# EAGLE schematic pcb v1 mod (EAGLE 7.4.0)
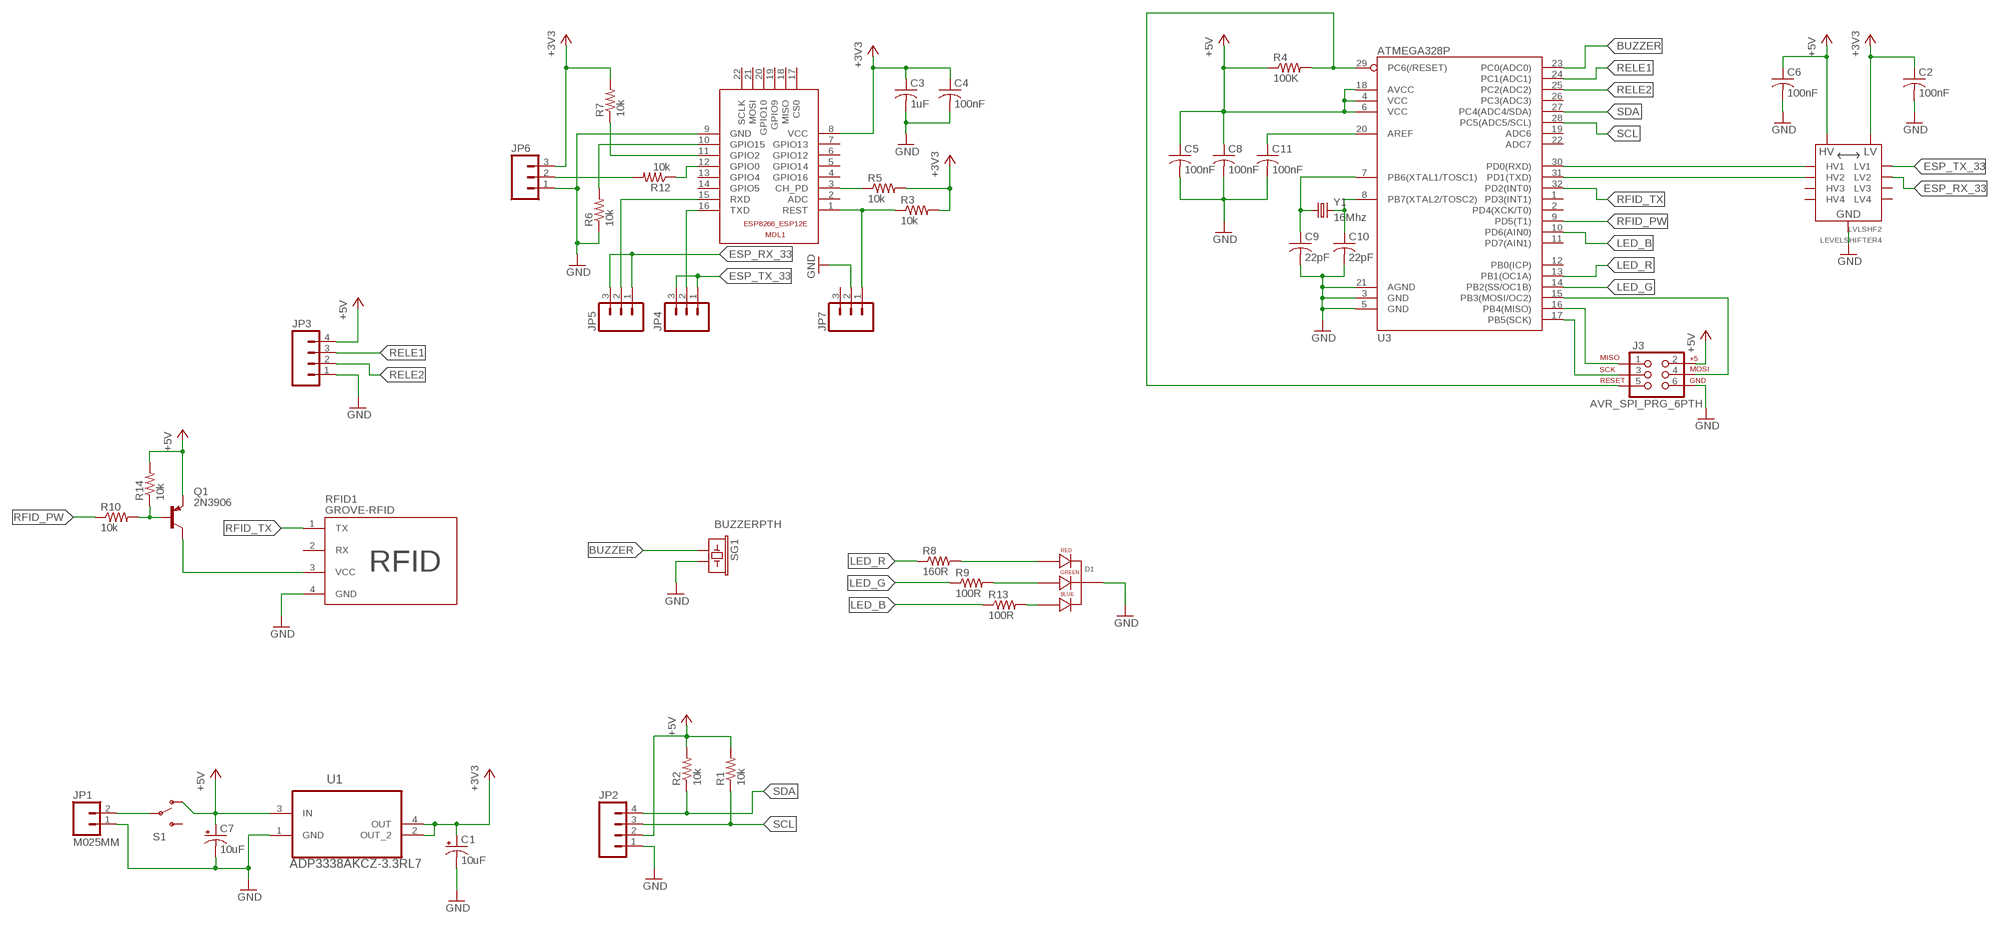
[diagram p0: schematic, sheet 1]

## Parts
C1  10uF  CPOL-USE2.5-6  [E2,5-6]
C2  100nF  C-USC0805  [C0805]
C3  1uF  C-USC1206  [C1206]
C4  100nF  C-USC0805  [C0805]
C5  100nF  C-USC0805  [C0805]
C6  100nF  C-USC0805  [C0805]
C7  10uF  CPOL-USE2.5-6  [E2,5-6]
C8  100nF  C-USC0805  [C0805]
C9  22pF  C-USC1206  [C1206]
C10  22pF  C-USC1206  [C1206]
C11  100nF  C-USC0805  [C0805]
D1  LED-RGB-CC-THRUCLEAR  [LED-RGB-THRU]
J3  AVR_SPI_PRG_6PTH  [2X3]
JP1  M025MM  [SCREWTERMINAL-5MM-2]
JP2  M04PTH  [1X04]
JP3  M04PTH  [1X04]
JP4  M03PTH  [1X03]
JP5  M03PTH  [1X03]
JP6  M03PTH  [1X03]
JP7  M03PTH  [1X03]
LVLSHF2  LEVELSHIFTER4  [LEVELSHIFTER4]
MDL1  ESP8266-12EESP8266-ESP12E  [ESP8266-ESP12E]
Q1  2N3906  [TO92]
R1  10k  R-US_R0805  [R0805]
R2  10k  R-US_R0805  [R0805]
R3  10k  R-US_R0805  [R0805]
R4  100K  R-US_R0805  [R0805]
R5  10k  R-US_R0805  [R0805]
R6  10k  R-US_R0805  [R0805]
R7  10k  R-US_R0805  [R0805]
R8  160R  R-US_R1206  [R1206]
R9  100R  R-US_R0805  [R0805]
R10  10k  R-US_R0805  [R0805]
R12  10k  R-US_R0805  [R0805]
R13  100R  R-US_R0805  [R0805]
R14  10k  R-US_R0805  [R0805]
RFID1  GROVE-RFID  [GROVE-RFID]
S1  SWITCH-SPDTPTH  [SWITCH-SPDT]
SG1  BUZZERPTH  [BUZZER-12MM]
U1  ADP3338AKCZ-3.3RL7  [SOT230P700X180-4N]
U3  ATMEGA328P  ATMEGA328_SMT  [TQFP32-08]
Y1  16Mhz  CRYSTALHC49US  [HC49US]

## Nets
+3V3: C1.+ C2.1 C3.1 C4.1 JP6.3 LVLSHF2.LV MDL1.8(VCC) R3.2 R5.2 R7.2 U1.2(OUT_2) U1.4(OUT)
+5V: C5.1 C6.1 C7.+ C8.1 J3.2 JP2.2 JP3.4 LVLSHF2.HV Q1.3(E) R1.2 R2.2 R4.1 R14.2 S1.1(O) U1.3(IN) U3.4(VCC) U3.6(VCC) U3.18(AVCC)
BUZZER: SG1.+ U3.23(PC0(ADC0))
ESP_RX_33: JP5.1 JP5.3 LVLSHF2.LV2
ESP_TX_33: JP4.1 JP4.3 LVLSHF2.LV1
GND: C1.- C2.2 C3.2 C4.2 C5.2 C6.2 C7.- C8.2 C9.2 C10.2 C11.2 D1.2(CATHODE) J3.6 JP1.1 JP2.1 JP3.1 JP6.1 JP7.2 LVLSHF2.GND LVLSHF2.GND1(GND) MDL1.9(GND) R6.1 RFID1.4(GND) SG1.- U1.1(GND) U3.3(GND) U3.5(GND) U3.21(AGND)
LED_B: R13.1 U3.10(PD6(AIN0))
LED_G: R9.1 U3.14(PB2(SS/OC1B))
LED_R: R8.1 U3.13(PB1(OC1A))
N$1: JP1.2 S1.2(P)
N$2: MDL1.3(CH_PD) R5.1
N$3: MDL1.11(GPIO2) R7.1
N$4: MDL1.12(GPIO0) R12.1
N$5: MDL1.10(GPIO15) R6.2
N$6: JP5.2 MDL1.15(RXD)
N$7: Q1.2(B) R10.2 R14.1
N$8: JP4.2 MDL1.16(TXD)
N$9: JP7.1 MDL1.1(REST) R3.1
N$10: D1.1(RED_CATHODE) R8.2
N$11: C9.1 U3.7(PB6(XTAL1/TOSC1)) Y1.1
N$12: C10.1 U3.8(PB7(XTAL2/TOSC2)) Y1.2
N$14: C11.1 U3.20(AREF)
N$15: D1.3(GREEN_CATHODE) R9.2
N$16: D1.4(BLUE_CATHODE) R13.2
N$17: J3.3 U3.17(PB5(SCK))
N$18: J3.1 U3.16(PB4(MISO))
N$19: J3.4 U3.15(PB3(MOSI/OC2))
N$20: JP6.2 R12.2
N$21: LVLSHF2.HV1 U3.30(PD0(RXD))
N$22: LVLSHF2.HV2 U3.31(PD1(TXD))
N$23: Q1.1(C) RFID1.3(VCC)
N$39: J3.5 R4.2 U3.29(PC6(/RESET))
RELE1: JP3.3 U3.24(PC1(ADC1))
RELE2: JP3.2 U3.25(PC2(ADC2))
RFID_PW: R10.1 U3.9(PD5(T1))
RFID_TX: RFID1.1(TX) U3.32(PD2(INT0))
SCL: JP2.3 R1.1 U3.28(PC5(ADC5/SCL))
SDA: JP2.4 R2.1 U3.27(PC4(ADC4/SDA))
Unconnected: JP7.3 LVLSHF2.HV3 LVLSHF2.HV4 LVLSHF2.LV3 LVLSHF2.LV4 MDL1.2(ADC) MDL1.4(GPIO16) MDL1.5(GPIO14) MDL1.6(GPIO12) MDL1.7(GPIO13) MDL1.13(GPIO4) MDL1.14(GPIO5) MDL1.17(CS0) MDL1.18(MISO) MDL1.19(GPIO9) MDL1.20(GPIO10) MDL1.21(MOSI) MDL1.22(SCLK) RFID1.2(RX) S1.3(S) U3.1(PD3(INT1)) U3.2(PD4(XCK/T0)) U3.11(PD7(AIN1)) U3.12(PB0(ICP)) U3.19(ADC6) U3.22(ADC7) U3.26(PC3(ADC3))

## Library data of the parts
C1 C7 = rcl:CPOL-US: POLARIZED CAPACITOR, American symbol
C2-C6 C8-C11 = rcl:C-US: CAPACITOR, American symbol
D1 = SparkFun-LED:LED-RGB-CC-THRU: RGB Through-hole common cathode LED SparkFun Storefront: COM-00105 (Clear) COM-09264 (Diffuse); PROD_ID: DIO-08418
J3 = SparkFun-Connectors:AVR_SPI_PRG_6: AVR ISP 6 Pin This is the reduced ISP connector for AVR programming. Common on Arduino. This footprint will take up less PCB space and can be used with a 10-pin to 6-pin adapter such as SKU: BOB-08508 **Special note about "TEST_POINT" package. The stop mask is on the top side, so if you want your programming test points to be on the bottom of your board, make sure to place this package on the bottom side of the board. This also ensure that the orientation to program from the bottom side will be correct.
JP1 = SparkFun-Connectors:M02: Standard 2-pin 0.1" header. Use with - straight break away headers ( PRT-00116) - right angle break away headers (PRT-00553) - swiss pins (PRT-00743) - machine pins (PRT-00117) - female headers (PRT-00115) Molex polarized connector foot print use with: PRT-08233 with associated crimp pins and housings. 2.54_SCREWTERM for use with PRT-10571. 3.5mm Screw Terminal footprints for PRT-08084 5mm Screw Terminal footprints for use with PRT-08432; STOREFRONT_ID: PRT-08432
JP2 JP3 = SparkFun-Connectors:M04: Header 4 Standard 4-pin 0.1" header. Use with straight break away headers (SKU : PRT-00116), right angle break away headers (PRT-00553), swiss pins (PRT-00743), machine pins (PRT-00117), and female headers (PRT-00115). Molex polarized connector foot print use with SKU : PRT-08231 with associated crimp pins and housings. 1MM SMD Version SKU: PRT-10208
JP4-JP7 = SparkFun-Connectors:M03: Header 3 Standard 3-pin 0.1" header. Use with straight break away headers (SKU : PRT-00116), right angle break away headers (PRT-00553), swiss pins (PRT-00743), machine pins (PRT-00117), and female headers (PRT-00115). Molex polarized connector foot print use with SKU : PRT-08232 with associated crimp pins and housings.
LVLSHF2 = partes:LEVELSHIFTER4
MDL1 = ESP8266-ESP12E:ESP8266-12E: ESP8266-12E with additional I/O and GPIO04/05 corrected The author cannot warrant that this library is free from error or will meet your specific requirements. Created by PuceBaboon.com. Komagane, Nagano, JAPAN
Q1 = transistor-pnp:2N3906: PNP Transistor
R1-R10 R12-R14 = rcl:R-US_: RESISTOR, American symbol
RFID1 = partes:GROVE-RFID
S1 = SparkFun-Electromechanical:SWITCH-SPDT: SPDT Switch Simple slide switch, Spark Fun Electronics SKU : COM-00102 DPDT SMT slide switch, AYZ0202, SWCH-08179; PROD_ID: SWCH-08261
SG1 = SparkFun-Electromechanical:BUZZER: Buzzer 12mm Spark Fun Electronics SKU : Comp-Buzzer
U1 = ADI-Phase-2:ADP3338AKCZ-3.3RL7: Low Dropout Regulator; MPN: ADP3338AKCZ-3.3RL7; OC_FARNELL: 1319313; OC_NEWARK: 19M8720; PACKAGE: SOT-223-3; SUPPLIER: Analog Devices
U3 = SparkFun-DigitalIC:ATMEGA328_SMT: 32-Pin Atmega328 part Commonly used on Arduino compatible boards Available in QFP and QFN packages TQFP is IC-09069 QFN is non-stock; PROD_ID: IC-09069
Y1 = SparkFun-FreqCtrl:CRYSTAL: Various standard crystals. Proven footprints. Spark Fun Electronics SKU : COM-00534